# EAGLE design puma_tpc_sipm16 (EAGLE 6.6.0)

## Sheet 1 of 9
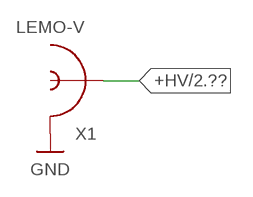
[diagram p0: schematic, sheet 1]

### Parts
X1  LEMO-V  [LEMO-V]

### Nets
+HV: X1.INNER ; also sheet 2,3,4,5,6,7,8,9
GND: X1.S1(SHIELD) X1.S2(SHIELD) X1.S3(SHIELD) X1.S4(SHIELD) ; also sheet 2,3,4,5,6,7,8,9

## Sheet 2 of 9
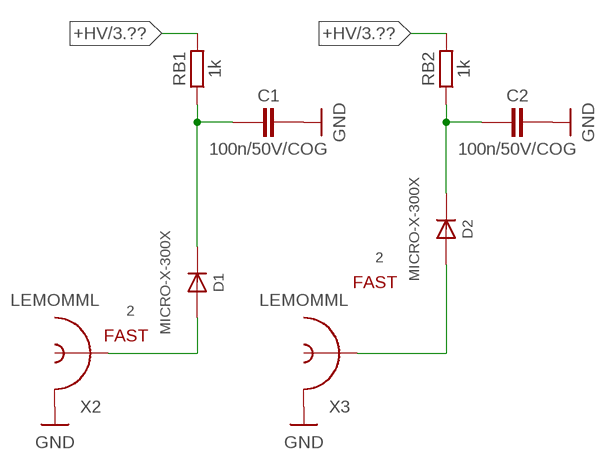
[diagram p1: schematic, sheet 2]

### Parts
C1  100n/50V/COG  C-EUCAP3216X130N  [CAP3216X130N]
C2  100n/50V/COG  C-EUCAP3216X130N  [CAP3216X130N]
D1  MICRO-X-300X  [MICROX-300XX]
D2  MICRO-X-300X  [MICROX-300XX]
RB1  1k  R-EU_RES1608X55N  [RES1608X55N]
RB2  1k  R-EU_RES1608X55N  [RES1608X55N]
X2  LEMOMML  [R302.302.000]
X3  LEMOMML  [R302.302.000]

### Nets
+HV: RB1.2 RB2.2 ; also sheet 1,3,4,5,6,7,8,9
A1: D1.1(A) X2.1(INNER)
A2: D2.1(A) X3.1(INNER)
FILT1: C1.1 D1.3(K) RB1.1
FILT2: C2.1 D2.3(K) RB2.1
GND: C1.2 C2.2 X2.GND@1(SHIELD) X2.GND@2(SHIELD) X2.GND@3(SHIELD) X3.GND@1(SHIELD) X3.GND@2(SHIELD) X3.GND@3(SHIELD) ; also sheet 1,3,4,5,6,7,8,9
Unconnected: D1.2(FAST) D1.4(NC) D2.2(FAST) D2.4(NC)

## Sheet 3 of 9
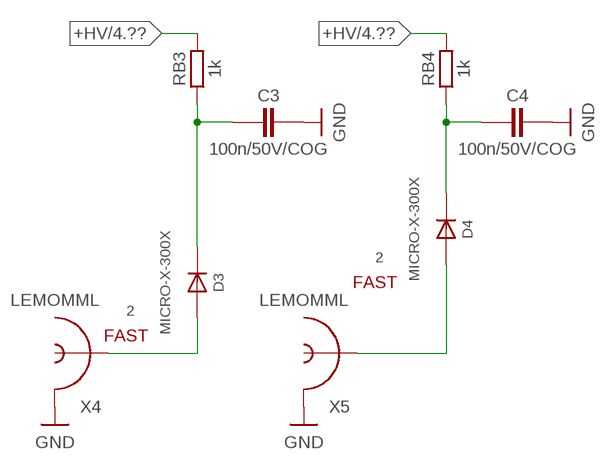
[diagram p2: schematic, sheet 3]

### Parts
C3  100n/50V/COG  C-EUCAP3216X130N  [CAP3216X130N]
C4  100n/50V/COG  C-EUCAP3216X130N  [CAP3216X130N]
D3  MICRO-X-300X  [MICROX-300XX]
D4  MICRO-X-300X  [MICROX-300XX]
RB3  1k  R-EU_RES1608X55N  [RES1608X55N]
RB4  1k  R-EU_RES1608X55N  [RES1608X55N]
X4  LEMOMML  [R302.302.000]
X5  LEMOMML  [R302.302.000]

### Nets
+HV: RB3.2 RB4.2 ; also sheet 1,2,4,5,6,7,8,9
A3: D3.1(A) X4.1(INNER)
A4: D4.1(A) X5.1(INNER)
FILT3: C3.1 D3.3(K) RB3.1
FILT4: C4.1 D4.3(K) RB4.1
GND: C3.2 C4.2 X4.GND@1(SHIELD) X4.GND@2(SHIELD) X4.GND@3(SHIELD) X5.GND@1(SHIELD) X5.GND@2(SHIELD) X5.GND@3(SHIELD) ; also sheet 1,2,4,5,6,7,8,9
Unconnected: D3.2(FAST) D3.4(NC) D4.2(FAST) D4.4(NC)

## Sheet 4 of 9
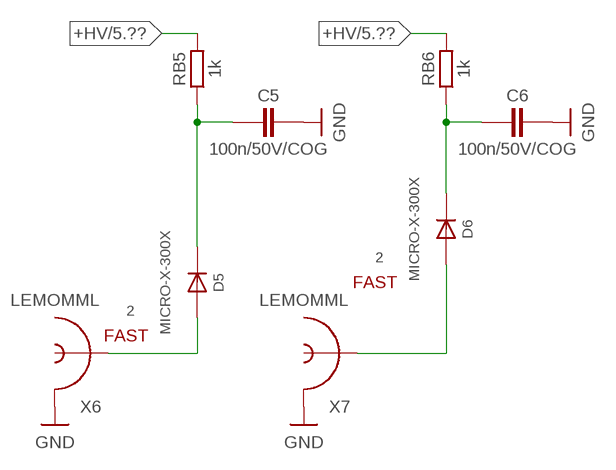
[diagram p3: schematic, sheet 4]

### Parts
C5  100n/50V/COG  C-EUCAP3216X130N  [CAP3216X130N]
C6  100n/50V/COG  C-EUCAP3216X130N  [CAP3216X130N]
D5  MICRO-X-300X  [MICROX-300XX]
D6  MICRO-X-300X  [MICROX-300XX]
RB5  1k  R-EU_RES1608X55N  [RES1608X55N]
RB6  1k  R-EU_RES1608X55N  [RES1608X55N]
X6  LEMOMML  [R302.302.000]
X7  LEMOMML  [R302.302.000]

### Nets
+HV: RB5.2 RB6.2 ; also sheet 1,2,3,5,6,7,8,9
A5: D5.1(A) X6.1(INNER)
A6: D6.1(A) X7.1(INNER)
FILT5: C5.1 D5.3(K) RB5.1
FILT6: C6.1 D6.3(K) RB6.1
GND: C5.2 C6.2 X6.GND@1(SHIELD) X6.GND@2(SHIELD) X6.GND@3(SHIELD) X7.GND@1(SHIELD) X7.GND@2(SHIELD) X7.GND@3(SHIELD) ; also sheet 1,2,3,5,6,7,8,9
Unconnected: D5.2(FAST) D5.4(NC) D6.2(FAST) D6.4(NC)

## Sheet 5 of 9
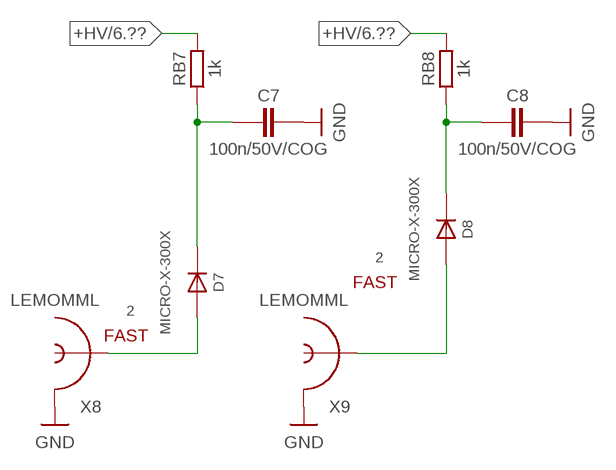
[diagram p4: schematic, sheet 5]

### Parts
C7  100n/50V/COG  C-EUCAP3216X130N  [CAP3216X130N]
C8  100n/50V/COG  C-EUCAP3216X130N  [CAP3216X130N]
D7  MICRO-X-300X  [MICROX-300XX]
D8  MICRO-X-300X  [MICROX-300XX]
RB7  1k  R-EU_RES1608X55N  [RES1608X55N]
RB8  1k  R-EU_RES1608X55N  [RES1608X55N]
X8  LEMOMML  [R302.302.000]
X9  LEMOMML  [R302.302.000]

### Nets
+HV: RB7.2 RB8.2 ; also sheet 1,2,3,4,6,7,8,9
A7: D7.1(A) X8.1(INNER)
A8: D8.1(A) X9.1(INNER)
FILT7: C7.1 D7.3(K) RB7.1
FILT8: C8.1 D8.3(K) RB8.1
GND: C7.2 C8.2 X8.GND@1(SHIELD) X8.GND@2(SHIELD) X8.GND@3(SHIELD) X9.GND@1(SHIELD) X9.GND@2(SHIELD) X9.GND@3(SHIELD) ; also sheet 1,2,3,4,6,7,8,9
Unconnected: D7.2(FAST) D7.4(NC) D8.2(FAST) D8.4(NC)

## Sheet 6 of 9
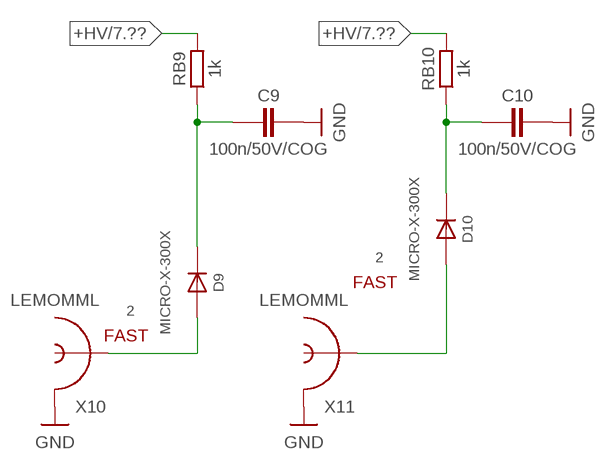
[diagram p5: schematic, sheet 6]

### Parts
C9  100n/50V/COG  C-EUCAP3216X130N  [CAP3216X130N]
C10  100n/50V/COG  C-EUCAP3216X130N  [CAP3216X130N]
D9  MICRO-X-300X  [MICROX-300XX]
D10  MICRO-X-300X  [MICROX-300XX]
RB9  1k  R-EU_RES1608X55N  [RES1608X55N]
RB10  1k  R-EU_RES1608X55N  [RES1608X55N]
X10  LEMOMML  [R302.302.000]
X11  LEMOMML  [R302.302.000]

### Nets
+HV: RB9.2 RB10.2 ; also sheet 1,2,3,4,5,7,8,9
A9: D9.1(A) X10.1(INNER)
A10: D10.1(A) X11.1(INNER)
FILT9: C9.1 D9.3(K) RB9.1
FILT10: C10.1 D10.3(K) RB10.1
GND: C9.2 C10.2 X10.GND@1(SHIELD) X10.GND@2(SHIELD) X10.GND@3(SHIELD) X11.GND@1(SHIELD) X11.GND@2(SHIELD) X11.GND@3(SHIELD) ; also sheet 1,2,3,4,5,7,8,9
Unconnected: D9.2(FAST) D9.4(NC) D10.2(FAST) D10.4(NC)

## Sheet 7 of 9
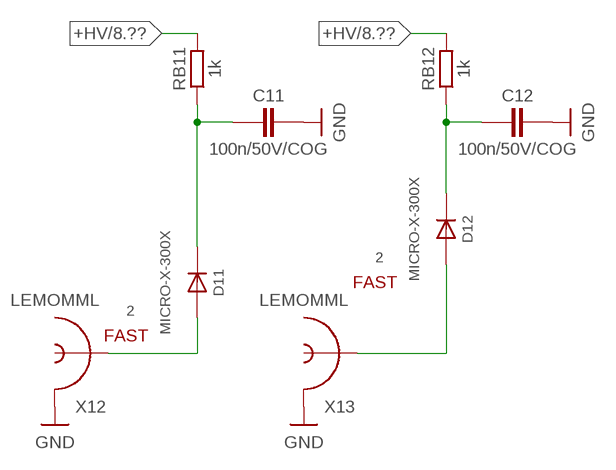
[diagram p6: schematic, sheet 7]

### Parts
C11  100n/50V/COG  C-EUCAP3216X130N  [CAP3216X130N]
C12  100n/50V/COG  C-EUCAP3216X130N  [CAP3216X130N]
D11  MICRO-X-300X  [MICROX-300XX]
D12  MICRO-X-300X  [MICROX-300XX]
RB11  1k  R-EU_RES1608X55N  [RES1608X55N]
RB12  1k  R-EU_RES1608X55N  [RES1608X55N]
X12  LEMOMML  [R302.302.000]
X13  LEMOMML  [R302.302.000]

### Nets
+HV: RB11.2 RB12.2 ; also sheet 1,2,3,4,5,6,8,9
A11: D11.1(A) X12.1(INNER)
A12: D12.1(A) X13.1(INNER)
FILT11: C11.1 D11.3(K) RB11.1
FILT12: C12.1 D12.3(K) RB12.1
GND: C11.2 C12.2 X12.GND@1(SHIELD) X12.GND@2(SHIELD) X12.GND@3(SHIELD) X13.GND@1(SHIELD) X13.GND@2(SHIELD) X13.GND@3(SHIELD) ; also sheet 1,2,3,4,5,6,8,9
Unconnected: D11.2(FAST) D11.4(NC) D12.2(FAST) D12.4(NC)

## Sheet 8 of 9
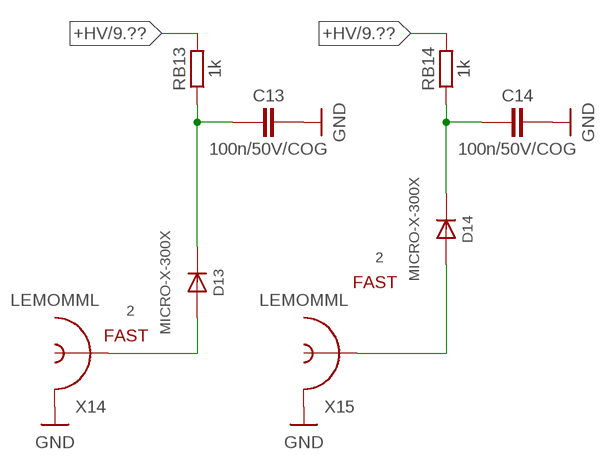
[diagram p7: schematic, sheet 8]

### Parts
C13  100n/50V/COG  C-EUCAP3216X130N  [CAP3216X130N]
C14  100n/50V/COG  C-EUCAP3216X130N  [CAP3216X130N]
D13  MICRO-X-300X  [MICROX-300XX]
D14  MICRO-X-300X  [MICROX-300XX]
RB13  1k  R-EU_RES1608X55N  [RES1608X55N]
RB14  1k  R-EU_RES1608X55N  [RES1608X55N]
X14  LEMOMML  [R302.302.000]
X15  LEMOMML  [R302.302.000]

### Nets
+HV: RB13.2 RB14.2 ; also sheet 1,2,3,4,5,6,7,9
A13: D13.1(A) X14.1(INNER)
A14: D14.1(A) X15.1(INNER)
FILT13: C13.1 D13.3(K) RB13.1
FILT14: C14.1 D14.3(K) RB14.1
GND: C13.2 C14.2 X14.GND@1(SHIELD) X14.GND@2(SHIELD) X14.GND@3(SHIELD) X15.GND@1(SHIELD) X15.GND@2(SHIELD) X15.GND@3(SHIELD) ; also sheet 1,2,3,4,5,6,7,9
Unconnected: D13.2(FAST) D13.4(NC) D14.2(FAST) D14.4(NC)

## Sheet 9 of 9
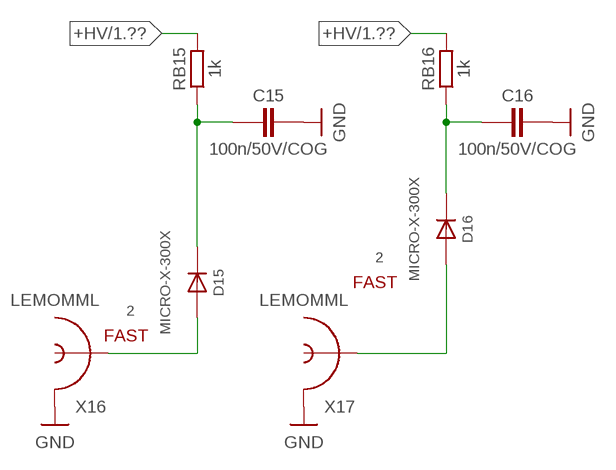
[diagram p8: schematic, sheet 9]

### Parts
C15  100n/50V/COG  C-EUCAP3216X130N  [CAP3216X130N]
C16  100n/50V/COG  C-EUCAP3216X130N  [CAP3216X130N]
D15  MICRO-X-300X  [MICROX-300XX]
D16  MICRO-X-300X  [MICROX-300XX]
RB15  1k  R-EU_RES1608X55N  [RES1608X55N]
RB16  1k  R-EU_RES1608X55N  [RES1608X55N]
X16  LEMOMML  [R302.302.000]
X17  LEMOMML  [R302.302.000]

### Nets
+HV: RB15.2 RB16.2 ; also sheet 1,2,3,4,5,6,7,8
A15: D15.1(A) X16.1(INNER)
A16: D16.1(A) X17.1(INNER)
FILT15: C15.1 D15.3(K) RB15.1
FILT16: C16.1 D16.3(K) RB16.1
GND: C15.2 C16.2 X16.GND@1(SHIELD) X16.GND@2(SHIELD) X16.GND@3(SHIELD) X17.GND@1(SHIELD) X17.GND@2(SHIELD) X17.GND@3(SHIELD) ; also sheet 1,2,3,4,5,6,7,8
Unconnected: D15.2(FAST) D15.4(NC) D16.2(FAST) D16.4(NC)

## Library data of the parts
C1-C16 = rcl:C-EU: CAPACITOR, European symbol
D1-D16 = local:MICRO*-?: MPPC Diode with Fast output
RB1-RB16 = rcl:R-EU_: RESISTOR, European symbol
X1-X17 = local:LEMO

## Board
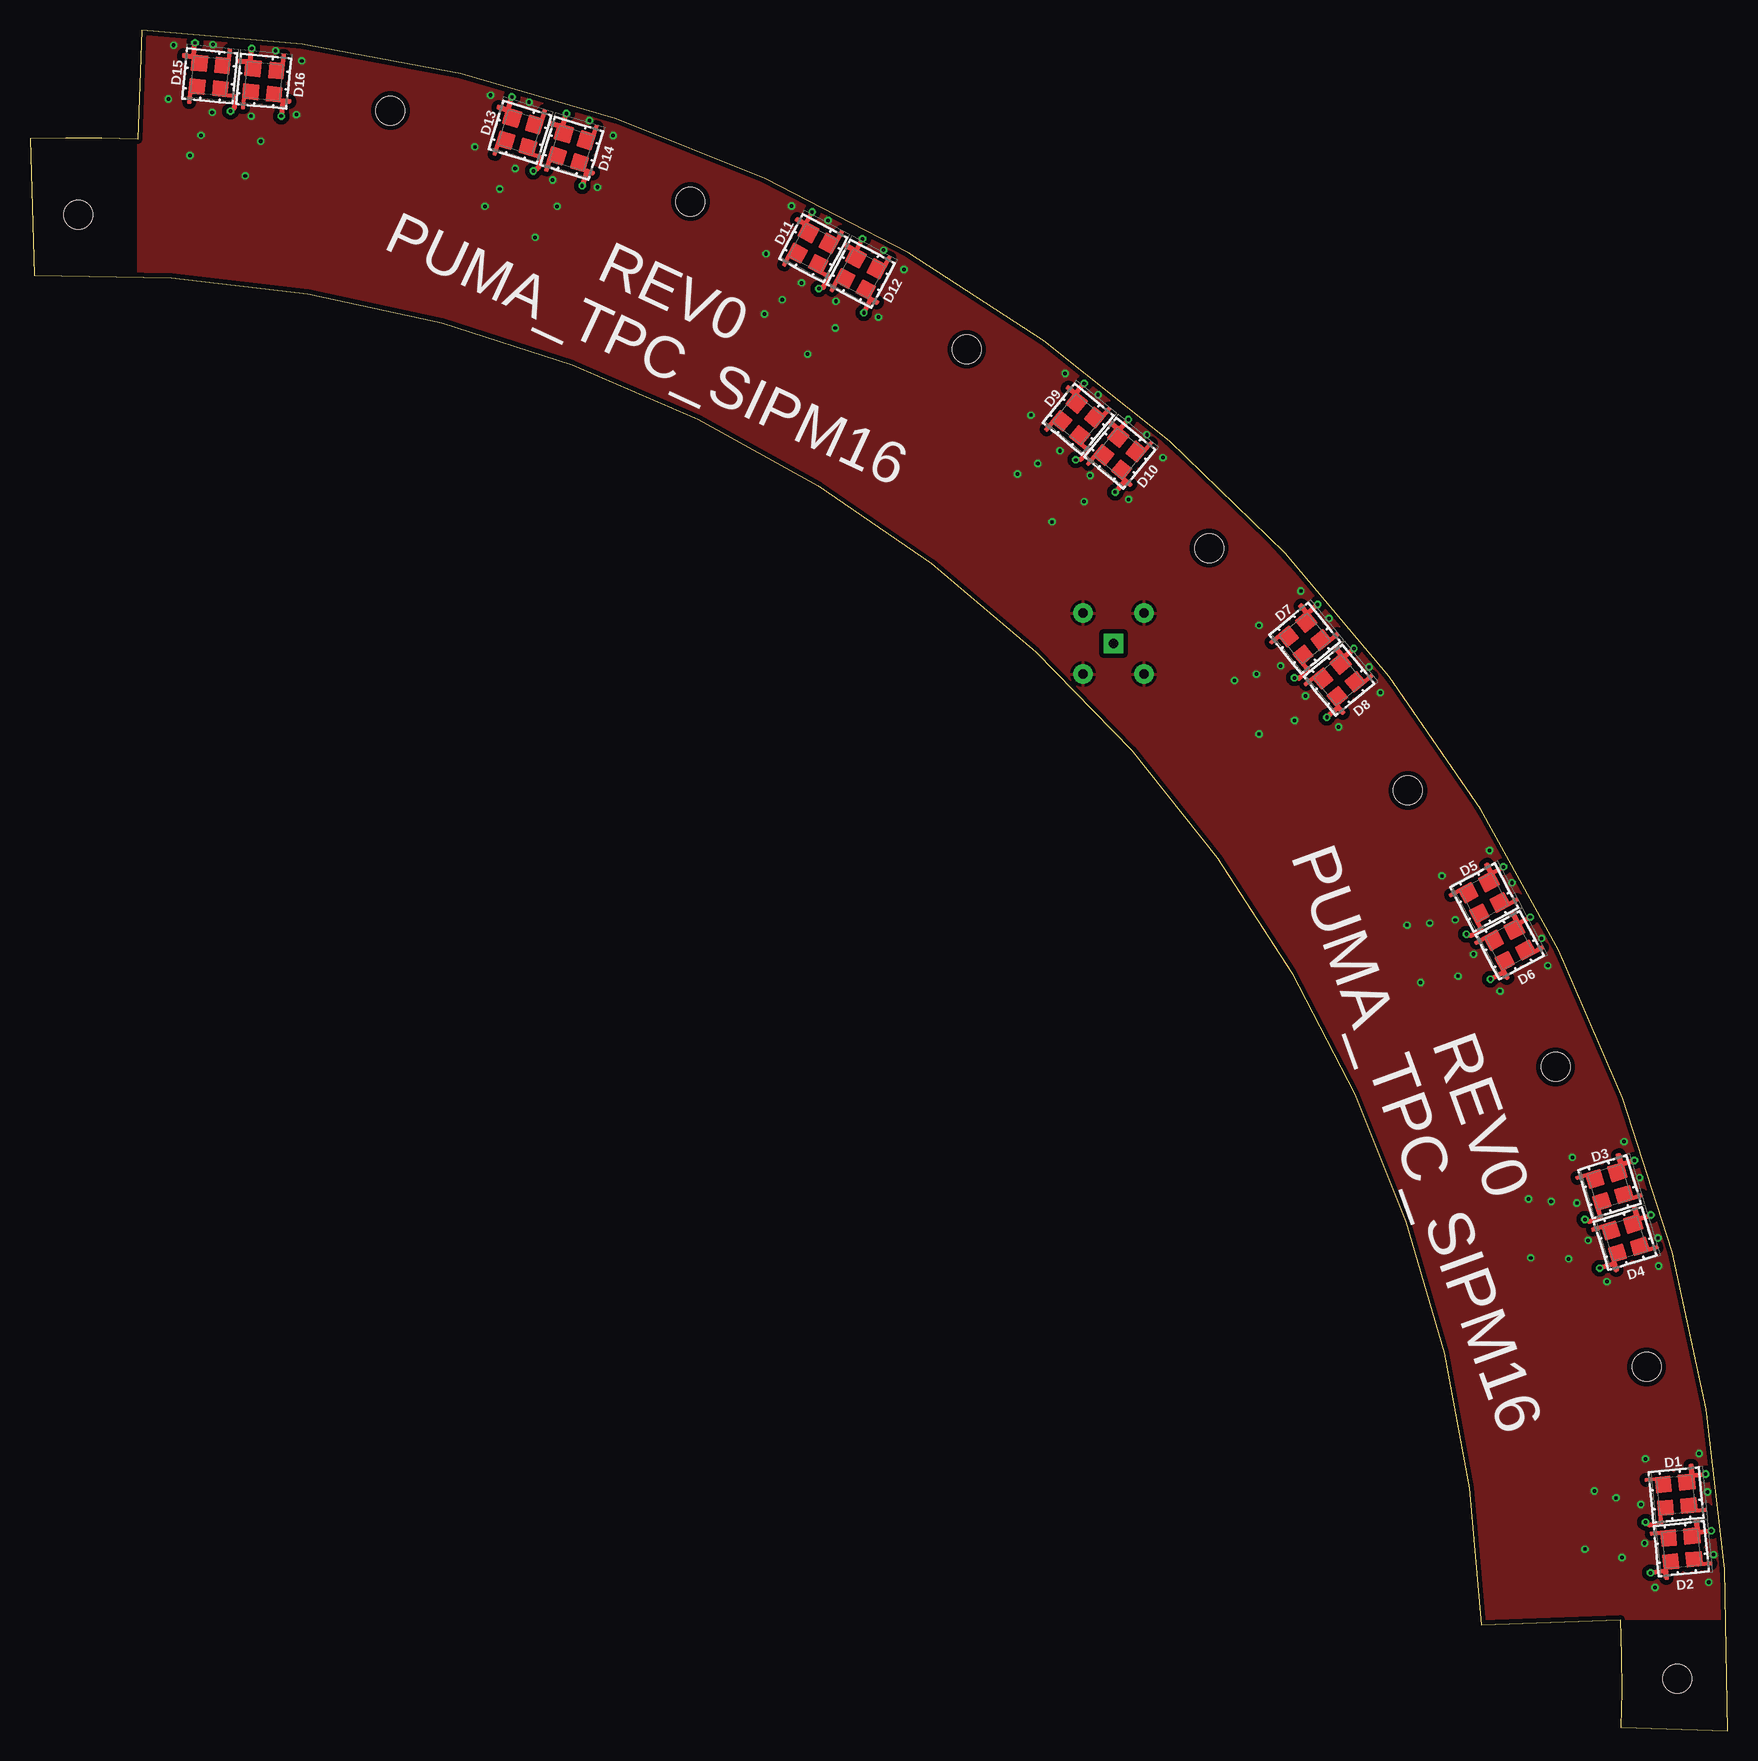
[diagram p9: board, top side]
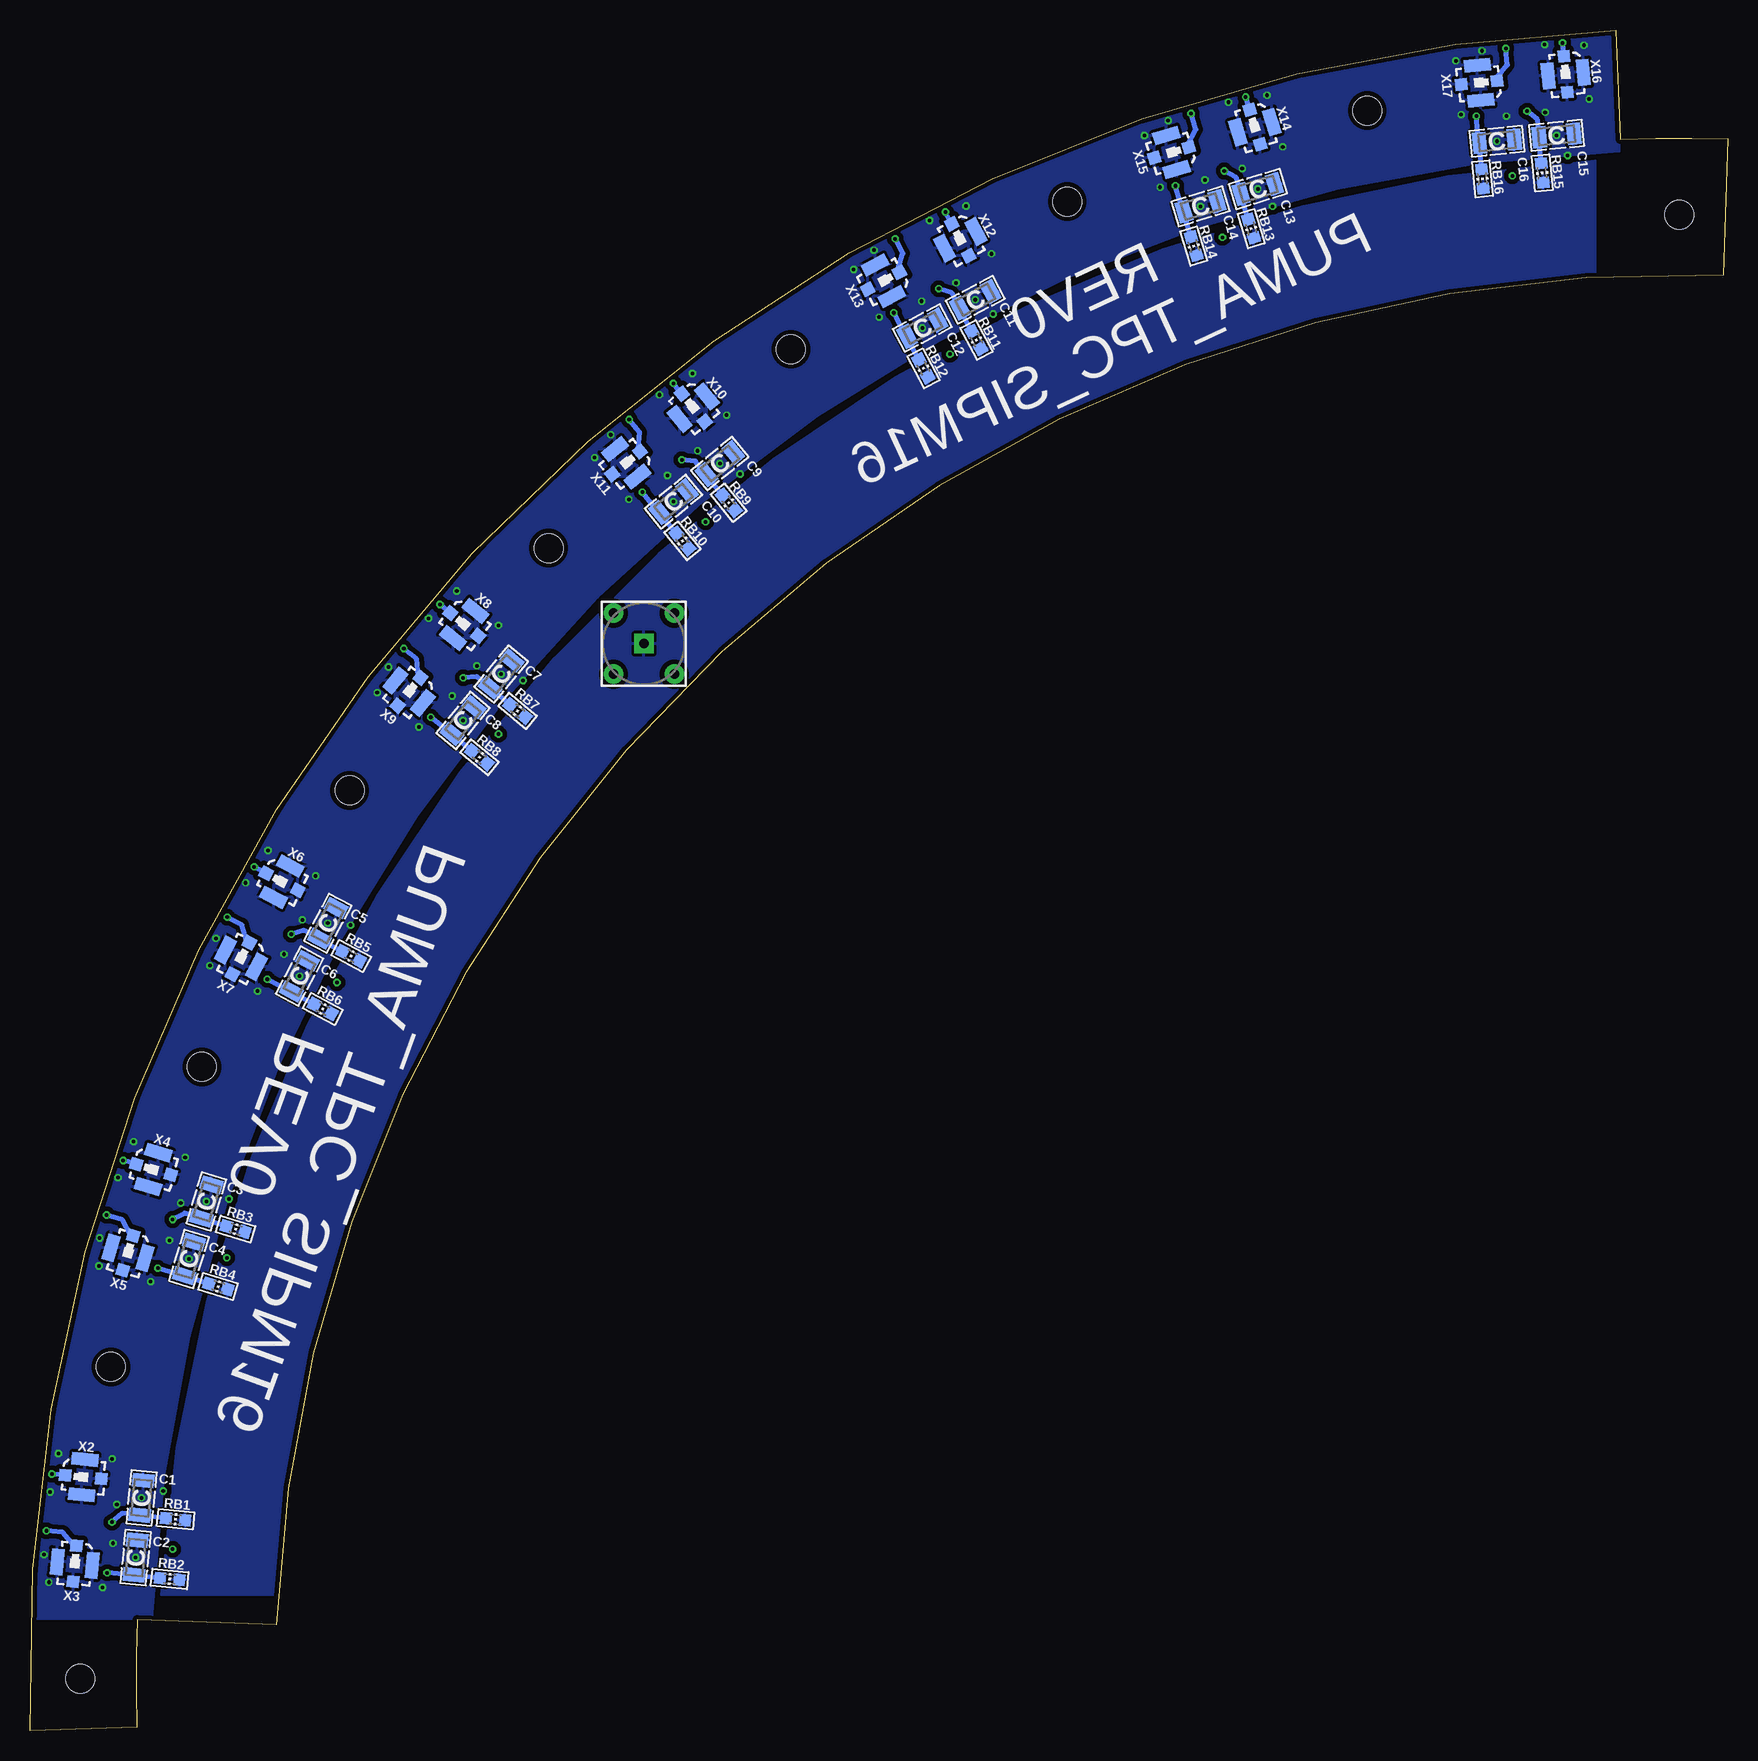
[diagram p10: board, bottom side, seen from below]

Size 141.47 x 141.72 mm. Coordinates in mm from the lower left corner, seen from the top.
Outline: 132.54,9.26 arc-4 132.57,0.28 141.47,0 arc90 9.31,141.72 8.96,132.62 arc4 0,132.66 0.36,121.26 arc-90 120.95,8.81 132.54,9.26
Copper layers (1*16): Top 0.035mm / dielectric 1.5mm / Bottom 0.035mm
Design rules "l200_s150_d300_2l *": minimum track width 0.2mm, minimum drill 0.3mm, track to track 0.15mm, track to pad 0.15mm, pad to pad 0.15mm, via to via 0.15mm, smd to smd 0mil, copper to edge 0.4mm, drill to drill 0.5mm, minimum pad ring 0.4mm, minimum via ring 0.15mm, stop-mask expansion 0mil, vias tented up to drill 0mil, thermal gap 10mil
Holes 2.4 mm at 137.28,4.32 134.72,30.31 127.14,55.31 114.83,78.35 98.26,98.54 78.06,115.11 55.03,127.43 30.03,135.01 4.03,126.32

### Footprints (pad centres in the part's own frame; a part is rotated, then mirrored left to right if it is on the bottom)
CAP3216X130N = smd 1.15 x 1.8: 1 -1.45,0; 2 1.45,0
MICROX-300XX = smd 0.2 x 0.2: 1 -1.48,-2.28; 2 2.28,-1.48; 3 1.48,2.28; 4 -2.28,1.48
RES1608X55N = smd 0.95 x 1: 1 -0.8,0; 2 0.8,0
LEMO-V = drill 0.813 pad 1.397 square: INNER 0,0 | drill 0.813 pad 1.397: S1 -2.54,2.54; S2 2.54,2.54; S3 -2.54,-2.54; S4 2.54,-2.54
R302.302.000 = smd 1 x 1: 1 0,-1.5; GND@3 0,1.5 | smd 1.05 x 2.2: GND@1 1.475,0; GND@2 -1.475,0

### Placement (x,y rotation side)
C1  132.17,19.4 84.4 bottom
C2  132.66,14.42 84.4 bottom
C3  126.77,44.1 73.1 bottom
C4  128.22,39.32 73.1 bottom
C5  116.65,67.28 61.9 bottom
C6  119.01,62.87 61.9 bottom
C7  102.2,88.04 50.6 bottom
C8  105.38,84.18 50.6 bottom
C9  83.98,105.59 39.4 bottom
C10  87.85,102.41 39.4 bottom
C11  62.69,119.24 28.1 bottom
C12  67.1,116.88 28.1 bottom
C13  39.14,128.47 16.9 bottom
C14  43.93,127.02 16.9 bottom
C15  14.25,132.94 5.6 bottom
C16  19.23,132.45 5.6 bottom
D1  137.17,19.63 185.6 top
D2  137.61,15.16 185.6 top
D3  131.63,45.31 196.9 top
D4  132.93,41.01 196.9 top
D5  121.18,69.42 208.1 top
D6  123.3,65.45 208.1 top
D7  106.23,91.02 219.4 top
D8  109.08,87.54 219.4 top
D9  87.35,109.29 230.6 top
D10  90.83,106.44 230.6 top
D11  65.27,123.53 241.9 top
D12  69.24,121.41 241.9 top
D13  40.83,133.19 253.1 top
D14  45.14,131.88 253.1 top
D15  14.99,137.89 264.4 top
D16  19.46,137.45 264.4 top
RB1  129.33,17.61 354.4 bottom
RB2  129.82,12.63 354.4 bottom
RB3  124.33,41.79 343.1 bottom
RB4  125.79,37.01 343.1 bottom
RB5  114.71,64.55 331.9 bottom
RB6  117.07,60.14 331.9 bottom
RB7  100.84,84.98 320.6 bottom
RB8  104.01,81.11 320.6 bottom
RB9  83.24,102.32 309.4 bottom
RB10  87.1,99.14 309.4 bottom
RB11  62.6,115.88 298.1 bottom
RB12  67.01,113.53 298.1 bottom
RB13  39.7,125.17 286.9 bottom
RB14  44.49,123.71 286.9 bottom
RB15  15.45,129.8 275.6 bottom
RB16  20.43,129.32 275.6 bottom
X1  90.3,90.59 0 bottom
X2  137.03,21.13 264.4 bottom
X3  137.74,13.91 174.4 bottom
X4  131.19,46.75 253.1 bottom
X5  133.3,39.81 163.1 bottom
X6  120.47,70.74 241.9 bottom
X7  123.89,64.35 151.9 bottom
X8  105.27,92.18 230.6 bottom
X9  109.88,86.58 140.6 bottom
X10  86.19,110.25 219.4 bottom
X11  91.79,105.64 129.4 bottom
X12  63.94,124.24 208.1 bottom
X13  70.34,120.82 118.1 bottom
X14  39.4,133.62 196.9 bottom
X15  46.34,131.51 106.9 bottom
X16  13.49,138.03 185.6 bottom
X17  20.71,137.33 95.6 bottom

### Tracks (layer width: path | path; a pad name or v marks a point on that pad's centre or on a via)
+HV
  pour Bottom (isolate 0.4): 130.53,11.32 arc83 11.03,130.82 11.03,121.32 arc-83 121.03,11.32
A1  (via drill 0.3)
  Top 0.4: D1.1 138.5,21.29 X2.1 v139.64,21.38
  Bottom 0.4: X2.1 v139.64,21.38
A2  (via drill 0.3)
  Top 0.4: D2.1 138.94,16.81 138.96,16.79 138.98,16.55 v140.1,16.66
  Bottom 0.4: X3.1 137.84,15.43 138.74,16.52 v140.1,16.66
A3  (via drill 0.3)
  Top 0.4: D3.1 132.6,47.2 X4.1 v133.7,47.51
  Bottom 0.4: X4.1 v133.7,47.51
A4  (via drill 0.3)
  Top 0.4: D4.1 133.91,42.89 133.93,42.88 134.01,42.64 v135.08,42.97
  Bottom 0.4: X5.1 133.1,41.32 133.77,42.57 v135.08,42.97
A5  (via drill 0.3)
  Top 0.4: D5.1 121.77,71.46 X6.1 v122.79,71.98
  Bottom 0.4: X6.1 v122.79,71.98
A6  (via drill 0.3)
  Top 0.4: D6.1 123.89,67.49 123.91,67.48 124.03,67.26 v125.03,67.79
  Bottom 0.4: X7.1 123.4,65.79 123.81,67.14 v125.03,67.79
A7  (via drill 0.3)
  Top 0.4: D7.1 106.4,93.13 X8.1 v107.3,93.85
  Bottom 0.4: X8.1 v107.3,93.85
A8  (via drill 0.3)
  Top 0.4: D8.1 109.26,89.66 109.29,89.65 109.45,89.46 v110.32,90.18
  Bottom 0.4: X9.1 109.12,87.9 109.25,89.3 v110.32,90.18
A9  (via drill 0.3)
  Top 0.4: D9.1 87.11,111.4 X10.1 v87.86,112.27
  Bottom 0.4: X10.1 v87.86,112.27
A10  (via drill 0.3)
  Top 0.4: D10.1 90.59,108.55 90.62,108.55 90.81,108.39 v91.53,109.26
  Bottom 0.4: X11.1 90.79,106.79 90.65,108.2 v91.53,109.26
A11  (via drill 0.3)
  Top 0.4: D11.1 64.62,125.55 X12.1 v65.18,126.55
  Bottom 0.4: X12.1 v65.18,126.55
A12  (via drill 0.3)
  Top 0.4: D12.1 68.59,123.43 68.62,123.44 68.84,123.32 v69.37,124.31
  Bottom 0.4: X13.1 69.13,121.75 68.72,123.1 v69.37,124.31
A13  (via drill 0.3)
  Top 0.4: D13.1 39.81,135.04 X14.1 v40.16,136.13
  Bottom 0.4: X14.1 v40.16,136.13
A14  (via drill 0.3)
  Top 0.4: D14.1 44.12,133.74 44.14,133.75 44.38,133.68 v44.71,134.75
  Bottom 0.4: X15.1 44.97,132.19 44.31,133.44 v44.71,134.75
A15  (via drill 0.3)
  Top 0.4: D15.1 13.62,139.51 X16.1 v13.75,140.65
  Bottom 0.4: X16.1 v13.75,140.65
A16  (via drill 0.3)
  Top 0.4: D16.1 18.1,139.07 18.12,139.09 18.37,139.06 v18.48,140.18
  Bottom 0.4: X17.1 19.24,137.72 18.34,138.81 v18.48,140.18
FILT1  (via drill 0.3)
  Top 0.4: D1.3 134.94,17.12 v134.63,17.38
  Bottom 0.4: v134.63,17.38 133.76,18.09 C1.1 132.32,17.9 RB1.1
FILT2  (via drill 0.3)
  Top 0.4: D2.3 136.31,13.25 136.29,13.27 v135.05,13.15
  Bottom 0.4: RB2.1 132.56,12.9 132.6,12.96 C2.1 132.81,12.93 v135.05,13.15
FILT3  (via drill 0.3)
  Top 0.4: D3.3 129.93,42.41 v129.58,42.6
  Bottom 0.4: v129.58,42.6 128.58,43.13 C3.1 127.21,42.66 RB3.1
FILT4  (via drill 0.3)
  Top 0.4: D4.3 132.03,38.88 132.01,38.9 v130.81,38.53
  Bottom 0.4: RB4.1 128.42,37.81 128.45,37.87 C4.1 128.66,37.88 v130.81,38.53
FILT5  (via drill 0.3)
  Top 0.4: D5.3 120.07,66.24 v119.69,66.36
  Bottom 0.4: v119.69,66.36 118.61,66.69 C5.1 117.36,65.96 RB5.1
FILT6  (via drill 0.3)
  Top 0.4: D6.3 122.83,63.19 122.8,63.2 v121.7,62.61
  Bottom 0.4: RB6.1 119.49,61.43 119.51,61.5 C6.1 119.71,61.55 v121.7,62.61
FILT7  (via drill 0.3)
  Top 0.4: D7.3 105.76,87.69 v105.37,87.73
  Bottom 0.4: v105.37,87.73 104.24,87.84 C7.1 103.16,86.88 RB7.1
FILT8  (via drill 0.3)
  Top 0.4: D8.3 109.06,85.24 109.03,85.24 v108.07,84.45
  Bottom 0.4: RB8.1 106.14,82.86 106.14,82.93 C8.1 106.33,83.02 v108.07,84.45
FILT9  (via drill 0.3)
  Top 0.4: D9.3 87.54,105.94 v87.15,105.9
  Bottom 0.4: v87.15,105.9 86.02,105.79 C9.1 85.14,104.64 RB9.1
FILT10  (via drill 0.3)
  Top 0.4: D10.3 91.25,104.17 91.23,104.17 v90.43,103.2
  Bottom 0.4: RB10.1 88.85,101.27 88.84,101.34 C10.1 89,101.46 v90.43,103.2
FILT11  (via drill 0.3)
  Top 0.4: D11.3 66.12,120.28 v65.74,120.16
  Bottom 0.4: v65.74,120.16 64.65,119.83 C11.1 64.02,118.53 RB11.1
FILT12  (via drill 0.3)
  Top 0.4: D12.3 70.1,119.27 70.07,119.26 v69.49,118.16
  Bottom 0.4: RB12.1 68.31,115.95 68.29,116.02 C12.1 68.43,116.17 v69.49,118.16
FILT13  (via drill 0.3)
  Top 0.4: D13.3 42.3,130.16 v41.95,129.97
  Bottom 0.4: v41.95,129.97 40.95,129.44 C13.1 40.58,128.04 RB13.1
FILT14  (via drill 0.3)
  Top 0.4: D14.3 46.4,129.95 46.38,129.93 v46.02,128.74
  Bottom 0.4: RB14.1 45.29,126.35 45.26,126.41 C14.1 45.36,126.58 v46.02,128.74
FILT15  (via drill 0.3)
  Top 0.4: D15.3 17.01,135.21 v16.71,134.96
  Bottom 0.4: v16.71,134.96 15.83,134.24 C15.1 15.74,132.79 RB15.1
FILT16  (via drill 0.3)
  Top 0.4: D16.3 21.08,135.8 21.06,135.78 v20.94,134.54
  Bottom 0.4: RB16.1 20.69,132.05 20.65,132.11 C16.1 20.72,132.3 v20.94,134.54
GND  (via drill 0.3)
  other vias: 132.17,19.4 132.66,14.42 134.62,22.65 139.79,19.89 139.9,12.37 129.58,15.12 130.36,19.97 135.42,11.93 134.24,18.84 134.55,15.61 140.3,14.67 139.1,23.09 126.77,44.1 128.22,39.32 128.53,47.77 134.14,46.08 135.72,38.72 125.06,39.4 124.88,44.31 131.41,37.41 128.9,43.96 129.85,40.85 135.66,41.05 132.83,49.08 116.65,67.28 119.01,62.87 117.66,71.23 123.49,70.66 126.48,63.75 115.89,62.34 114.75,67.12 122.51,61.63 118.77,67.57 120.3,64.7 125.97,66.02 121.63,73.35 102.2,88.04 105.38,84.18 102.42,92.1 108.25,92.69 112.53,86.5 102.42,83.05 100.37,87.51 109.05,83.64 104.22,88.73 106.29,86.22 111.59,88.63 105.9,94.96 83.98,105.59 87.85,102.41 83.41,109.62 89.01,111.32 94.41,106.08 85.17,100.73 82.29,104.71 91.56,102.6 85.83,106.66 88.34,104.59 93.07,107.99 86.27,113.09 62.69,119.24 67.1,116.88 61.34,123.07 66.5,125.84 72.83,121.76 64.81,114.71 61.21,118.05 70.71,117.79 64.3,120.65 67.16,119.12 71.13,123.37 63.46,127.04 39.14,128.47 43.93,127.02 37.07,131.98 41.6,135.7 48.59,132.92 42.1,124.44 37.92,127.02 47.28,128.61 40.44,130.17 43.55,129.23 46.62,134.17 38.38,136.28 14.25,132.94 19.23,132.45 11.53,135.97 15.24,140.5 22.65,139.15 17.94,129.56 13.33,131.27 22.21,134.67 15.19,134.85 18.43,134.54 20.47,139.99 11.97,140.44
  pour Top (isolate 0.4): 121.03,9.32 arc85 9.03,121.32 9.03,141.32 arc-86 141.03,9.32
  pour Bottom (isolate 0.4): 131.33,9.32 arc86 9.03,131.62 9.03,141.32 arc-86 141.03,9.32

### Text on the board
tPlace: REV0 / PUMA_TPC_SIPM16 | REV0 / PUMA_TPC_SIPM16
bPlace: REV0 / PUMA_TPC_SIPM16 | REV0 / PUMA_TPC_SIPM16